# EAGLE design arduino backpack (EAGLE 6.1)
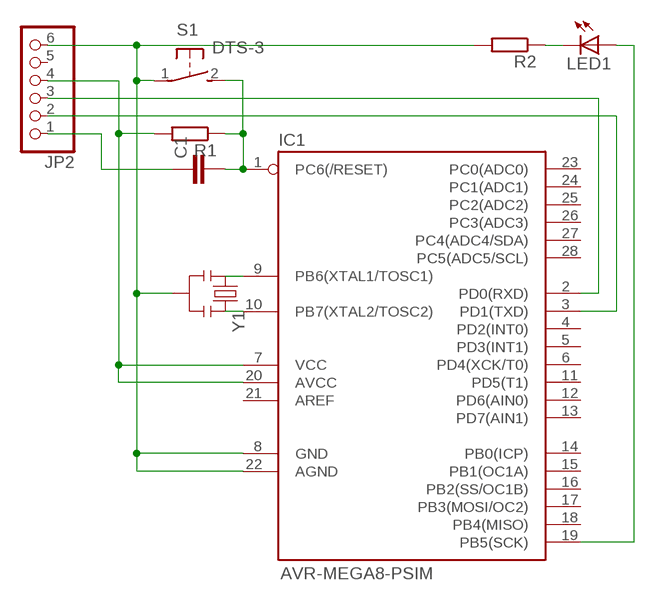
[diagram p0: schematic, sheet 1]

## Parts
C1  C-EU025-025X050  [C025-025X050]
IC1  AVR-MEGA8-PSIM  [DIL28-3-SIMON]
JP2  PINHD-1X6  [1X06]
LED1  LED3MM  [LED3MM]
R1  R-EU_0204/2V  [0204V]
R2  R-EU_0204/2V  [0204V]
S1  DTS-3  [DTS-3]
Y1  RESONATORPTH  [RESONATOR-PTH]

## Nets
N$1: IC1.8(GND) IC1.22(AGND) JP2.6 R2.2 S1.1 Y1.2
N$2: IC1.7(VCC) IC1.20(AVCC) JP2.4 R1.2
N$3: IC1.2(PD0(RXD)) JP2.3
N$4: IC1.3(PD1(TXD)) JP2.2
N$5: C1.1 JP2.1
N$6: C1.2 IC1.1(PC6(/RESET)) R1.1 S1.2
N$7: IC1.9(PB6(XTAL1/TOSC1)) Y1.1
N$8: IC1.10(PB7(XTAL2/TOSC2)) Y1.3
N$9: LED1.K(C) R2.1
N$10: IC1.19(PB5(SCK)) LED1.A
Unconnected: IC1.4(PD2(INT0)) IC1.5(PD3(INT1)) IC1.6(PD4(XCK/T0)) IC1.11(PD5(T1)) IC1.12(PD6(AIN0)) IC1.13(PD7(AIN1)) IC1.14(PB0(ICP)) IC1.15(PB1(OC1A)) IC1.16(PB2(SS/OC1B)) IC1.17(PB3(MOSI/OC2)) IC1.18(PB4(MISO)) IC1.21(AREF) IC1.23(PC0(ADC0)) IC1.24(PC1(ADC1)) IC1.25(PC2(ADC2)) IC1.26(PC3(ADC3)) IC1.27(PC4(ADC4/SDA)) IC1.28(PC5(ADC5/SCL)) JP2.5

## Library data of the parts
C1 = rcl:C-EU: CAPACITOR, European symbol
IC1 = SparkFun-DigitalIC:AVR-MEGA8-P: MICROCONTROLLER 8 Kbytes FLASH 1 kbytes SRAM 512 bytes EEPROM USART 4-channel 10 bit ADC 2-channel 8 bit ADC
JP2 = adafruit:PINHD-1X6: PIN HEADER
LED1 = led:LED: LED OSRAM: - CHIPLED LG R971, LG N971, LY N971, LG Q971, LY Q971, LO R971, LY R971 LH N974, LH R974 LS Q976, LO Q976, LY Q976 LO Q996 - Hyper CHIPLED LW Q18S LB Q993, LB Q99A, LB R99A - SideLED LS A670, LO A670, LY A670, LG A670, LP A670 LB A673, LV A673, LT A673, LW A673 LH A674 LY A675 LS A676, LA A676, LO A676, LY A676, LW A676 LS A679, LY A679, LG A679 - Hyper Micro SIDELED® LS Y876, LA Y876, LO Y876, LY Y876 LT Y87S - SmartLED LW L88C, LW L88S LB L89C, LB L89S, LG L890 LS L89K, LO L89K, LY L89K LS L896, LA L896, LO L896, LY L896 - TOPLED LS T670, LO T670, LY T670, LG T670, LP T670 LSG T670, LSP T670, LSY T670, LOP T670, LYG T670 LG T671, LOG T671, LSG T671 LB T673, LV T673, LT T673, LW T673 LH T674 LS T676, LA T676, LO T676, LY T676, LB T676, LH T676, LSB T676, LW T676 LB T67C, LV T67C, LT T67C, LS T67K, LO T67K, LY T67K, LW E67C LS E67B, LA E67B, LO E67B, LY E67B, LB E67C, LV E67C, LT E67C LW T67C LS T679, LY T679, LG T679 LS T770, LO T770, LY T770, LG T770, LP T770 LB T773, LV T773, LT T773, LW T773 LH T774 LS E675, LA E675, LY E675, LS T675 LS T776, LA T776, LO T776, LY T776, LB T776 LHGB T686 LT T68C, LB T68C - Hyper Mini TOPLED® LB M676 - Mini TOPLED Santana® LG M470 LS M47K, LO M47K, LY M47K Source: http://www.osram.convergy.de LUXEON: - LUMILED® LXK2-PW12-R00, LXK2-PW12-S00, LXK2-PW14-U00, LXK2-PW14-V00 LXK2-PM12-R00, LXK2-PM12-S00, LXK2-PM14-U00 LXK2-PE12-Q00, LXK2-PE12-R00, LXK2-PE12-S00, LXK2-PE14-T00, LXK2-PE14-U00 LXK2-PB12-K00, LXK2-PB12-L00, LXK2-PB12-M00, LXK2-PB14-N00, LXK2-PB14-P00, LXK2-PB14-Q00 LXK2-PR12-L00, LXK2-PR12-M00, LXK2-PR14-Q00, LXK2-PR14-R00 LXK2-PD12-Q00, LXK2-PD12-R00, LXK2-PD12-S00 LXK2-PH12-R00, LXK2-PH12-S00 LXK2-PL12-P00, LXK2-PL12-Q00, LXK2-PL12-R00 Source: www.luxeon.com KINGBRIGHT: KA-3528ASYC Source: www.kingbright.com
R1 R2 = rcl:R-EU_: RESISTOR, European symbol
S1 = _MY_OWN_LIB:DTS-3
Y1 = SparkFun-FreqCtrl:RESONATOR: Resonator Small SMD resonator. Used, eg, on the Arduino Pro/ Pro Mini boards. 8MHz- XTAL-08895 16MHz- XTAL-08900

## Board
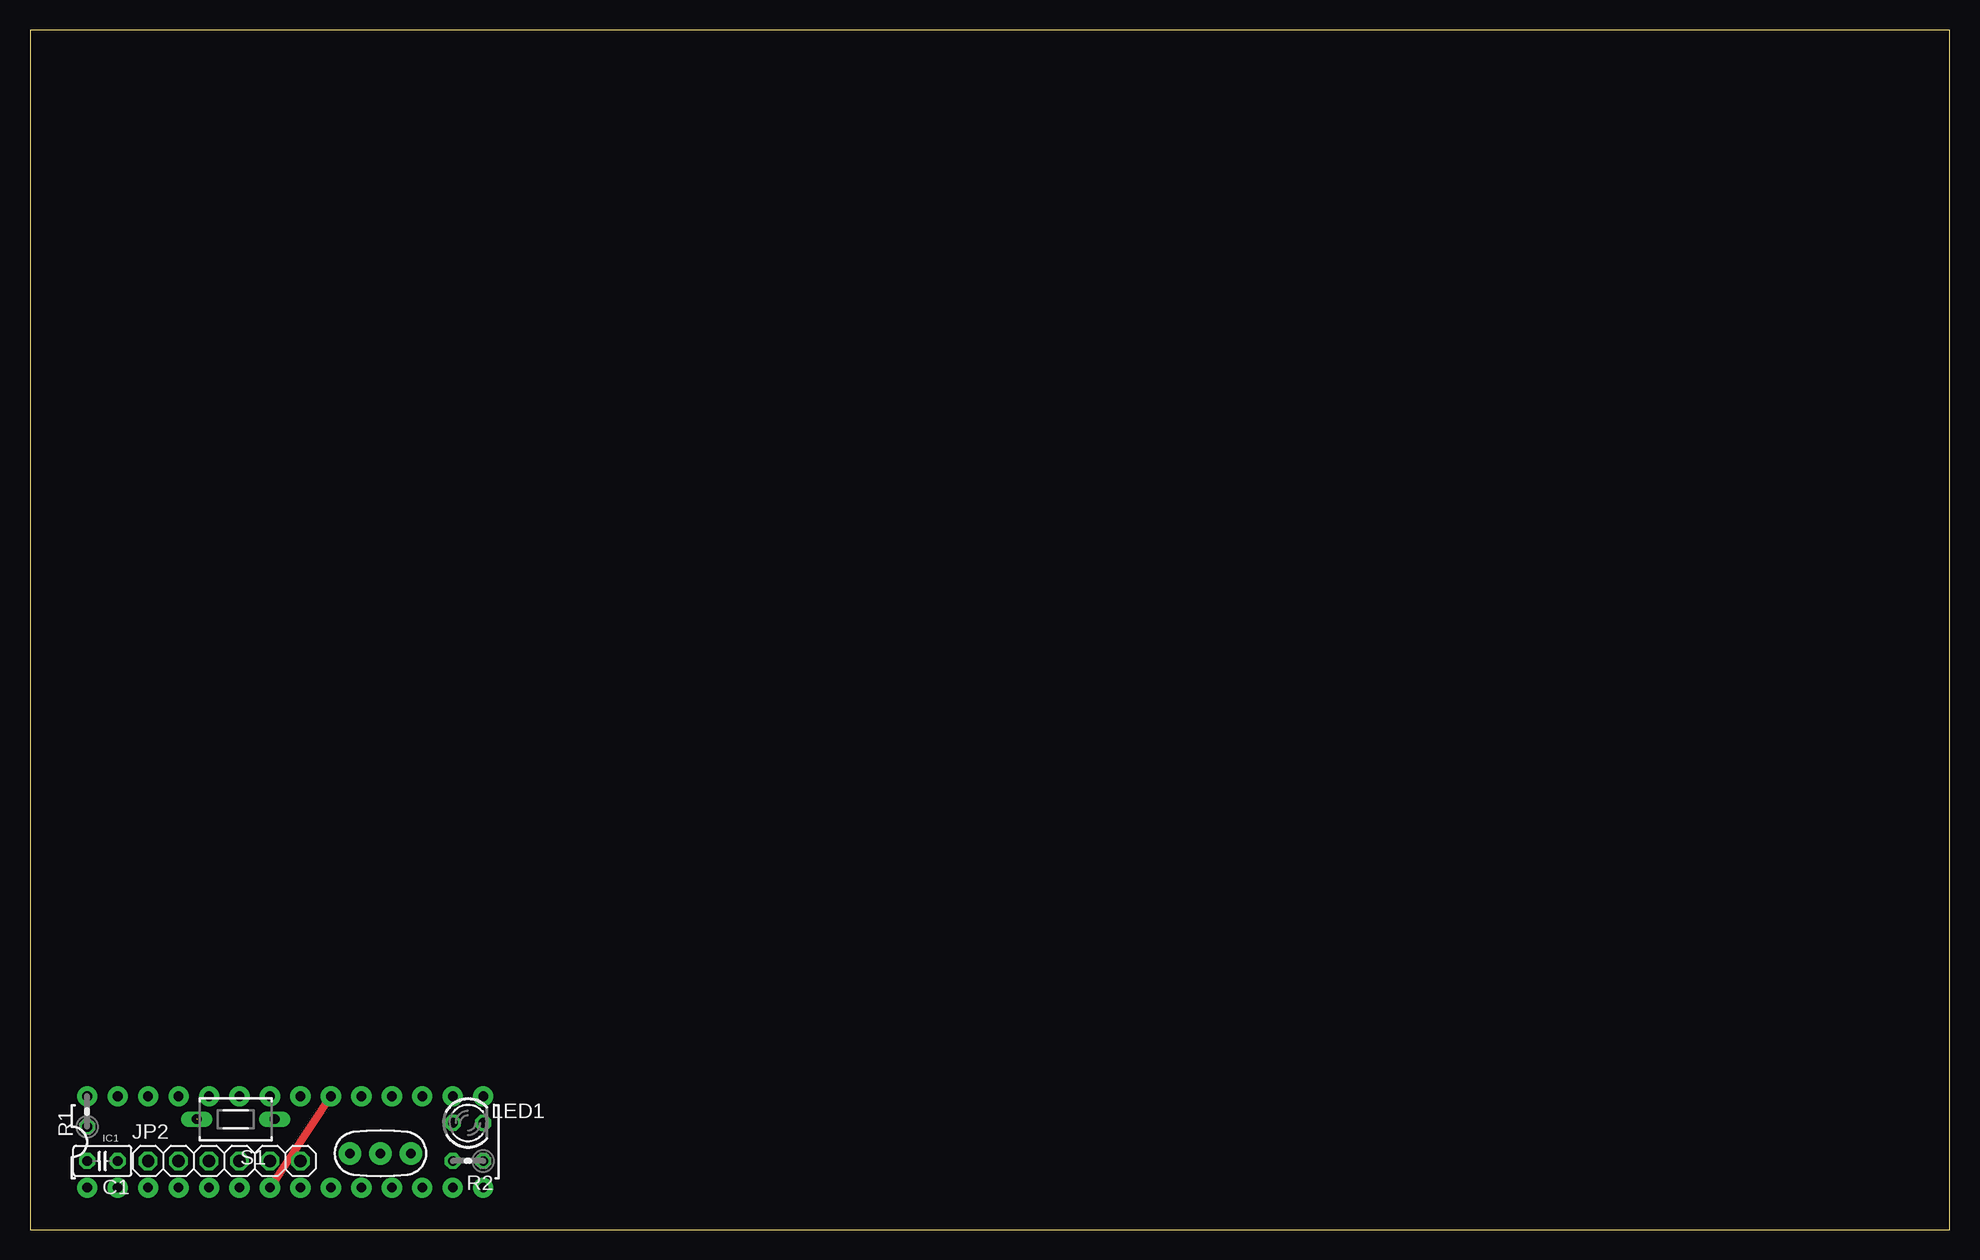
[diagram p1: board, top side]
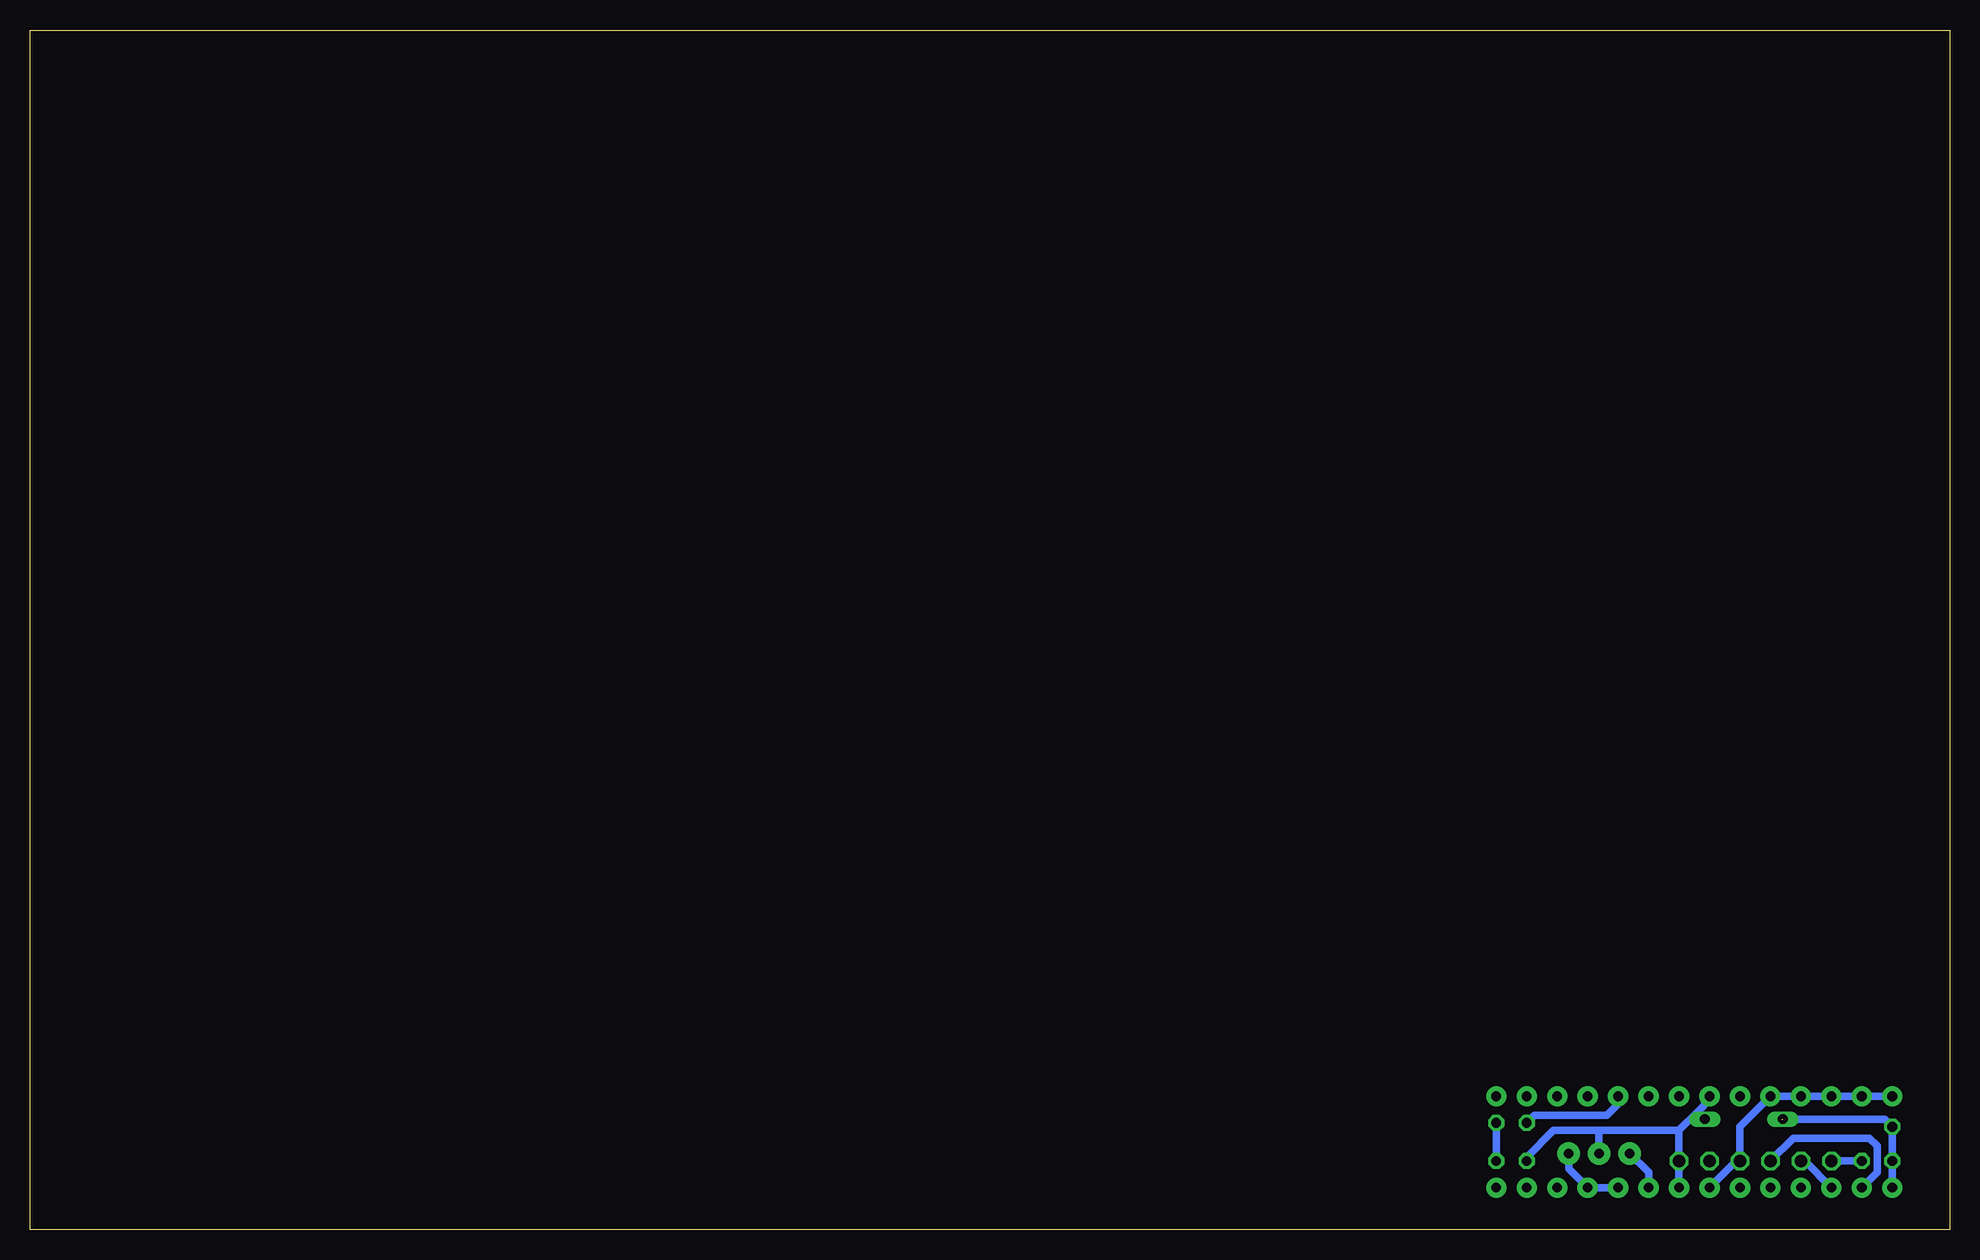
[diagram p2: board, bottom side, seen from below]

Size 160 x 100 mm. Coordinates in mm from the lower left corner, seen from the top.
Outline: 0,0 160,0 160,100 0,100 0,0
Copper layers (1*16): Top 0.035mm / dielectric 1.5mm / Bottom 0.035mm
Design rules: minimum track width 10mil, minimum drill 24mil, track to track 12mil, track to pad 12mil, pad to pad 12mil, via to via 12mil, smd to smd 10mil, copper to edge 12mil, drill to drill 12mil, minimum pad ring 10mil, minimum via ring 10mil, stop-mask expansion 4mil, vias tented up to drill 0mil, thermal gap 12mil

### Footprints (pad centres in the part's own frame; a part is rotated, then mirrored left to right if it is on the bottom)
C025-025X050 = drill 0.813 octagon: 1 -1.27,0; 2 1.27,0
DIL28-3-SIMON = drill 0.813 pad 1.676: 1 -16.51,-3.81; 2 -13.97,-3.81; 3 -11.43,-3.81; 4 -8.89,-3.81; 5 -6.35,-3.81; 6 -3.81,-3.81; 7 -1.27,-3.81; 8 1.27,-3.81; 9 3.81,-3.81; 10 6.35,-3.81; 11 8.89,-3.81; 12 11.43,-3.81; 13 13.97,-3.81; 14 16.51,-3.81; 15 16.51,3.81; 16 13.97,3.81; 17 11.43,3.81; 18 8.89,3.81; 19 6.35,3.81; 20 3.81,3.81; 21 1.27,3.81; 22 -1.27,3.81; 23 -3.81,3.81; 24 -6.35,3.81; 25 -8.89,3.81; 26 -11.43,3.81; 27 -13.97,3.81; 28 -16.51,3.81
1X06 = drill 1.016 octagon: 1 -6.35,0; 2 -3.81,0; 3 -1.27,0; 4 1.27,0; 5 3.81,0; 6 6.35,0
LED3MM = drill 0.813 octagon: A -1.27,0; K 1.27,0
0204V = drill 0.813 octagon: 1 -1.27,0; 2 1.27,0
DTS-3 = drill 0.8 long: 1 -3.25,0; 2 3.25,0
RESONATOR-PTH = drill 0.8 pad 1.88: 1 -2.54,0; 2 0,0; 3 2.54,0

### Placement (x,y rotation side)
C1  6.03,5.71 180 top
IC1  21.27,7.3 0 top
JP2  16.19,5.71 0 top
LED1  36.51,8.89 0 top
R1  4.76,9.84 90 top
R2  36.51,5.71 180 top
S1  17.14,9.21 180 top
Y1  29.21,6.35 0 top

### Tracks (layer width: path | path; a pad name or v marks a point on that pad's centre or on a via)
N$1
  Bottom 0.61: R2.2 35.24,6.03 33.02,8.26 29.21,8.26 | Y1.2 29.21,8.26 | IC1.22 20,10.79 20.95,9.84 | 20.95,9.84 22.54,8.26 | 29.21,8.26 22.54,8.26 | S1.1 20.39,9.28 20.95,9.84 | IC1.8 JP2.6 22.54,8.26
N$2
  Top 0.61: IC1.20 IC1.7
  Bottom 0.61: R1.2 14.92,11.11 17.46,8.57 JP2.4 17.78,5.71 IC1.7
N$3
  Bottom 0.61: IC1.2 6.03,4.76 6.03,6.99 6.67,7.62 13.02,7.62 JP2.3
N$4
  Bottom 0.61: IC1.3 12.06,5.71 JP2.2
N$5
  Bottom 0.61: C1.1 JP2.1
N$6  (1 unrouted)
  Bottom 0.61: IC1.1 C1.2 R1.1 5.4,9.21 13.97,9.21
N$7
  Bottom 0.61: IC1.9 25.08,4.76 Y1.1
N$8
  Bottom 0.61: IC1.10 30.16,3.49 31.75,5.08 Y1.3
N$9
  Bottom 0.61: R2.1 LED1.K
N$10
  Bottom 0.61: IC1.19 27.62,10.48 28.57,9.53 34.61,9.53 LED1.A